# EAGLE design main_328p (EAGLE 9.6.2)
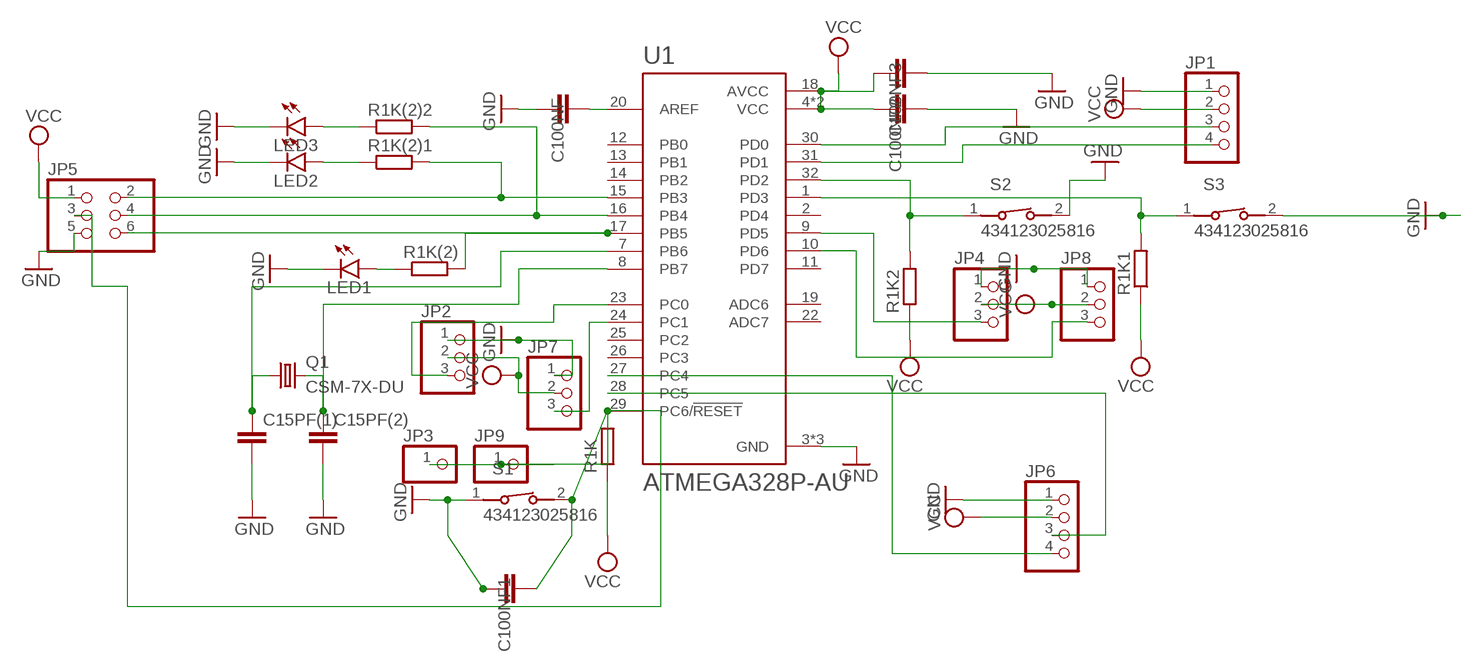
[diagram p0: schematic, sheet 1]

## Parts
C15PF(1)  C-EUC0603  [C0603]
C15PF(2)  C-EUC0603  [C0603]
C100NF  C-EUC0603  [C0603]
C100NF1  C-EUC0603  [C0603]
C100NF2  C-EUC0603  [C0603]
C100NF3  C-EUC0603  [C0603]
JP1  PINHD-1X04_2.54-SMD  [1X04SMD]
JP2  PINHD-1X03_2.54-SMD  [1X03SMD]
JP3  PINHD-1X01_2.54  [1X01]
JP4  PINHD-1X03_2.54-SMD  [1X03SMD]
JP5  PINHD-2X03_2.54-SMD  [2X03SMD]
JP6  PINHD-1X04_2.54-SMD  [1X04SMD]
JP7  PINHD-1X03_2.54-SMD  [1X03SMD]
JP8  PINHD-1X03_2.54-SMD  [1X03SMD]
JP9  PINHD-1X01_2.54  [1X01]
LED1  LEDCHIPLED_1206  [CHIPLED_1206]
LED2  LEDCHIPLED_1206  [CHIPLED_1206]
LED3  LEDCHIPLED_1206  [CHIPLED_1206]
Q1  CSM-7X-DU  [CSM-7X-DU]
R1K  R-EU_R1206  [R1206]
R1K1  R-EU_R1206  [R1206]
R1K2  R-EU_R1206  [R1206]
R1K(2)  R-EU_R1206  [R1206]
R1K(2)1  R-EU_R1206  [R1206]
R1K(2)2  R-EU_R1206  [R1206]
S1  434123025816  [434123025816]
S2  434123025816  [434123025816]
S3  434123025816  [434123025816]
U1  ATMEGA328P-AU  [QFP80P900X900X120-32N]

## Nets
GND: C15PF(1).2 C15PF(2).2 C100NF1.1 C100NF2.2 C100NF3.2 C100NF.1 JP1.1 JP2.1 JP4.1 JP5.5 JP6.1 JP7.1 JP8.1 LED1.C LED2.C LED3.C S1.1 S2.2 S3.2 U1.3(GND) U1.5(GND) U1.21(GND)
N$1: JP2.3 U1.23(PC0)
N$2: C15PF(1).1 Q1.1 U1.7(PB6)
N$3: LED1.A R1K(2).1
N$4: C100NF.2 U1.20(AREF)
N$5: JP7.3 U1.24(PC1)
N$6: JP5.6 R1K(2).2 U1.17(PB5)
N$7: LED3.A R1K(2)2.1
N$8: LED2.A R1K(2)1.1
N$9: JP6.4 U1.27(PC4)
N$10: C15PF(2).1 Q1.2 U1.8(PB7)
N$11: JP6.3 U1.28(PC5)
N$12: R1K2.2 S2.1 U1.32(PD2)
N$13: JP5.2 R1K(2)1.2 U1.15(PB3)
N$14: R1K1.2 S3.1 U1.1(PD3)
N$15: JP1.3 U1.30(PD0)
N$16: JP1.4 U1.31(PD1)
N$17: JP4.3 U1.9(PD5)
N$18: JP8.3 U1.10(PD6)
N$26: C100NF1.2 JP3.1 JP5.3 JP9.1 R1K.2 S1.2 U1.29(PC6/!RESET)
N$27: JP5.4 R1K(2)2.2 U1.16(PB4)
VCC: C100NF2.1 C100NF3.1 JP1.2 JP2.2 JP4.2 JP5.1 JP6.2 JP7.2 JP8.2 R1K1.1 R1K2.1 R1K.1 U1.4(VCC) U1.6(VCC) U1.18(AVCC)
Unconnected: U1.2(PD4) U1.11(PD7) U1.12(PB0) U1.13(PB1) U1.14(PB2) U1.19(ADC6) U1.22(ADC7) U1.25(PC2) U1.26(PC3)

## Library data of the parts
C15PF(1) C15PF(2) C100NF C100NF1-C100NF3 = rcl:C-EU: CAPACITOR, European symbol; SPICEPREFIX: C
JP1 JP6 = pinhead-2:PINHD-1X04: PIN HEADER
JP2 JP4 JP7 JP8 = pinhead-2:PINHD-1X03: PIN HEADER
JP3 JP9 = pinhead-2:PINHD-1X01: PIN HEADER
JP5 = pinhead-2:PINHD-2X03: PIN HEADER
LED1-LED3 = led:LED: LED OSRAM: - CHIPLED LG R971, LG N971, LY N971, LG Q971, LY Q971, LO R971, LY R971 LH N974, LH R974 LS Q976, LO Q976, LY Q976 LO Q996 - Hyper CHIPLED LW Q18S LB Q993, LB Q99A, LB R99A - SideLED LS A670, LO A670, LY A670, LG A670, LP A670 LB A673, LV A673, LT A673, LW A673 LH A674 LY A675 LS A676, LA A676, LO A676, LY A676, LW A676 LS A679, LY A679, LG A679 - Hyper Micro SIDELED® LS Y876, LA Y876, LO Y876, LY Y876 LT Y87S - SmartLED LW L88C, LW L88S LB L89C, LB L89S, LG L890 LS L89K, LO L89K, LY L89K LS L896, LA L896, LO L896, LY L896 - TOPLED LS T670, LO T670, LY T670, LG T670, LP T670 LSG T670, LSP T670, LSY T670, LOP T670, LYG T670 LG T671, LOG T671, LSG T671 LB T673, LV T673, LT T673, LW T673 LH T674 LS T676, LA T676, LO T676, LY T676, LB T676, LH T676, LSB T676, LW T676 LB T67C, LV T67C, LT T67C, LS T67K, LO T67K, LY T67K, LW E67C LS E67B, LA E67B, LO E67B, LY E67B, LB E67C, LV E67C, LT E67C LW T67C LS T679, LY T679, LG T679 LS T770, LO T770, LY T770, LG T770, LP T770 LB T773, LV T773, LT T773, LW T773 LH T774 LS E675, LA E675, LY E675, LS T675 LS T776, LA T776, LO T776, LY T776, LB T776 LHGB T686 LT T68C, LB T68C - Hyper Mini TOPLED® LB M676 - Mini TOPLED Santana® LG M470 LS M47K, LO M47K, LY M47K Source: http://www.osram.convergy.de LUXEON: - LUMILED® LXK2-PW12-R00, LXK2-PW12-S00, LXK2-PW14-U00, LXK2-PW14-V00 LXK2-PM12-R00, LXK2-PM12-S00, LXK2-PM14-U00 LXK2-PE12-Q00, LXK2-PE12-R00, LXK2-PE12-S00, LXK2-PE14-T00, LXK2-PE14-U00 LXK2-PB12-K00, LXK2-PB12-L00, LXK2-PB12-M00, LXK2-PB14-N00, LXK2-PB14-P00, LXK2-PB14-Q00 LXK2-PR12-L00, LXK2-PR12-M00, LXK2-PR14-Q00, LXK2-PR14-R00 LXK2-PD12-Q00, LXK2-PD12-R00, LXK2-PD12-S00 LXK2-PH12-R00, LXK2-PH12-S00 LXK2-PL12-P00, LXK2-PL12-Q00, LXK2-PL12-R00 Source: www.luxeon.com KINGBRIGHT: KA-3528ASYC Source: www.kingbright.com
Q1 = crystal:CSM-7X-DU: SMD CRYSTAL Source: www.ecsxtal.com .. Crystal 3.6864MHz CSM_7X_DU.PDF; OC_FARNELL: unknown; OC_NEWARK: unknown
R1K R1K1 R1K2 R1K(2) R1K(2)1 R1K(2)2 = rcl:R-EU_: RESISTOR, European symbol; SPICEPREFIX: R
S1-S3 = 434123025816:434123025816: 6.0x3.8 mm SMD J-Bend WS-TASV <http://katalog.we-online.de/media/images/v2/Family_WS-TASV_J-Bend_SMD_6.0x3.jpg> Details see: http://katalog.we-online.de/em/datasheet/4341x30258xx.pdf 2015 (C) Wurth Elektronik; AVAILABILITY: Unavailable; DESCRIPTION: Tactile Switch SPST-NO Top Actuated Surface Mount; MF: Wurth Electronics; MP: 434123025816; PACKAGE: None; PRICE: None
U1 = ATMEGA328P-AU:ATMEGA328P-AU: ATmega Series 20 MHz 32 KB Flash 2 KB SRAM 8-Bit Microcontroller - TQFP-32; AVAILABILITY: Unavailable; DESCRIPTION: AVR AVR® ATmega Microcontroller IC 8-Bit 20MHz 32KB _16K x 16_ FLASH 32-TQFP _7x7_; MF: Microchip Technology; MP: ATMEGA328P-AU; PACKAGE: TQFP-32 Microchip Technology; PRICE: None

## Board
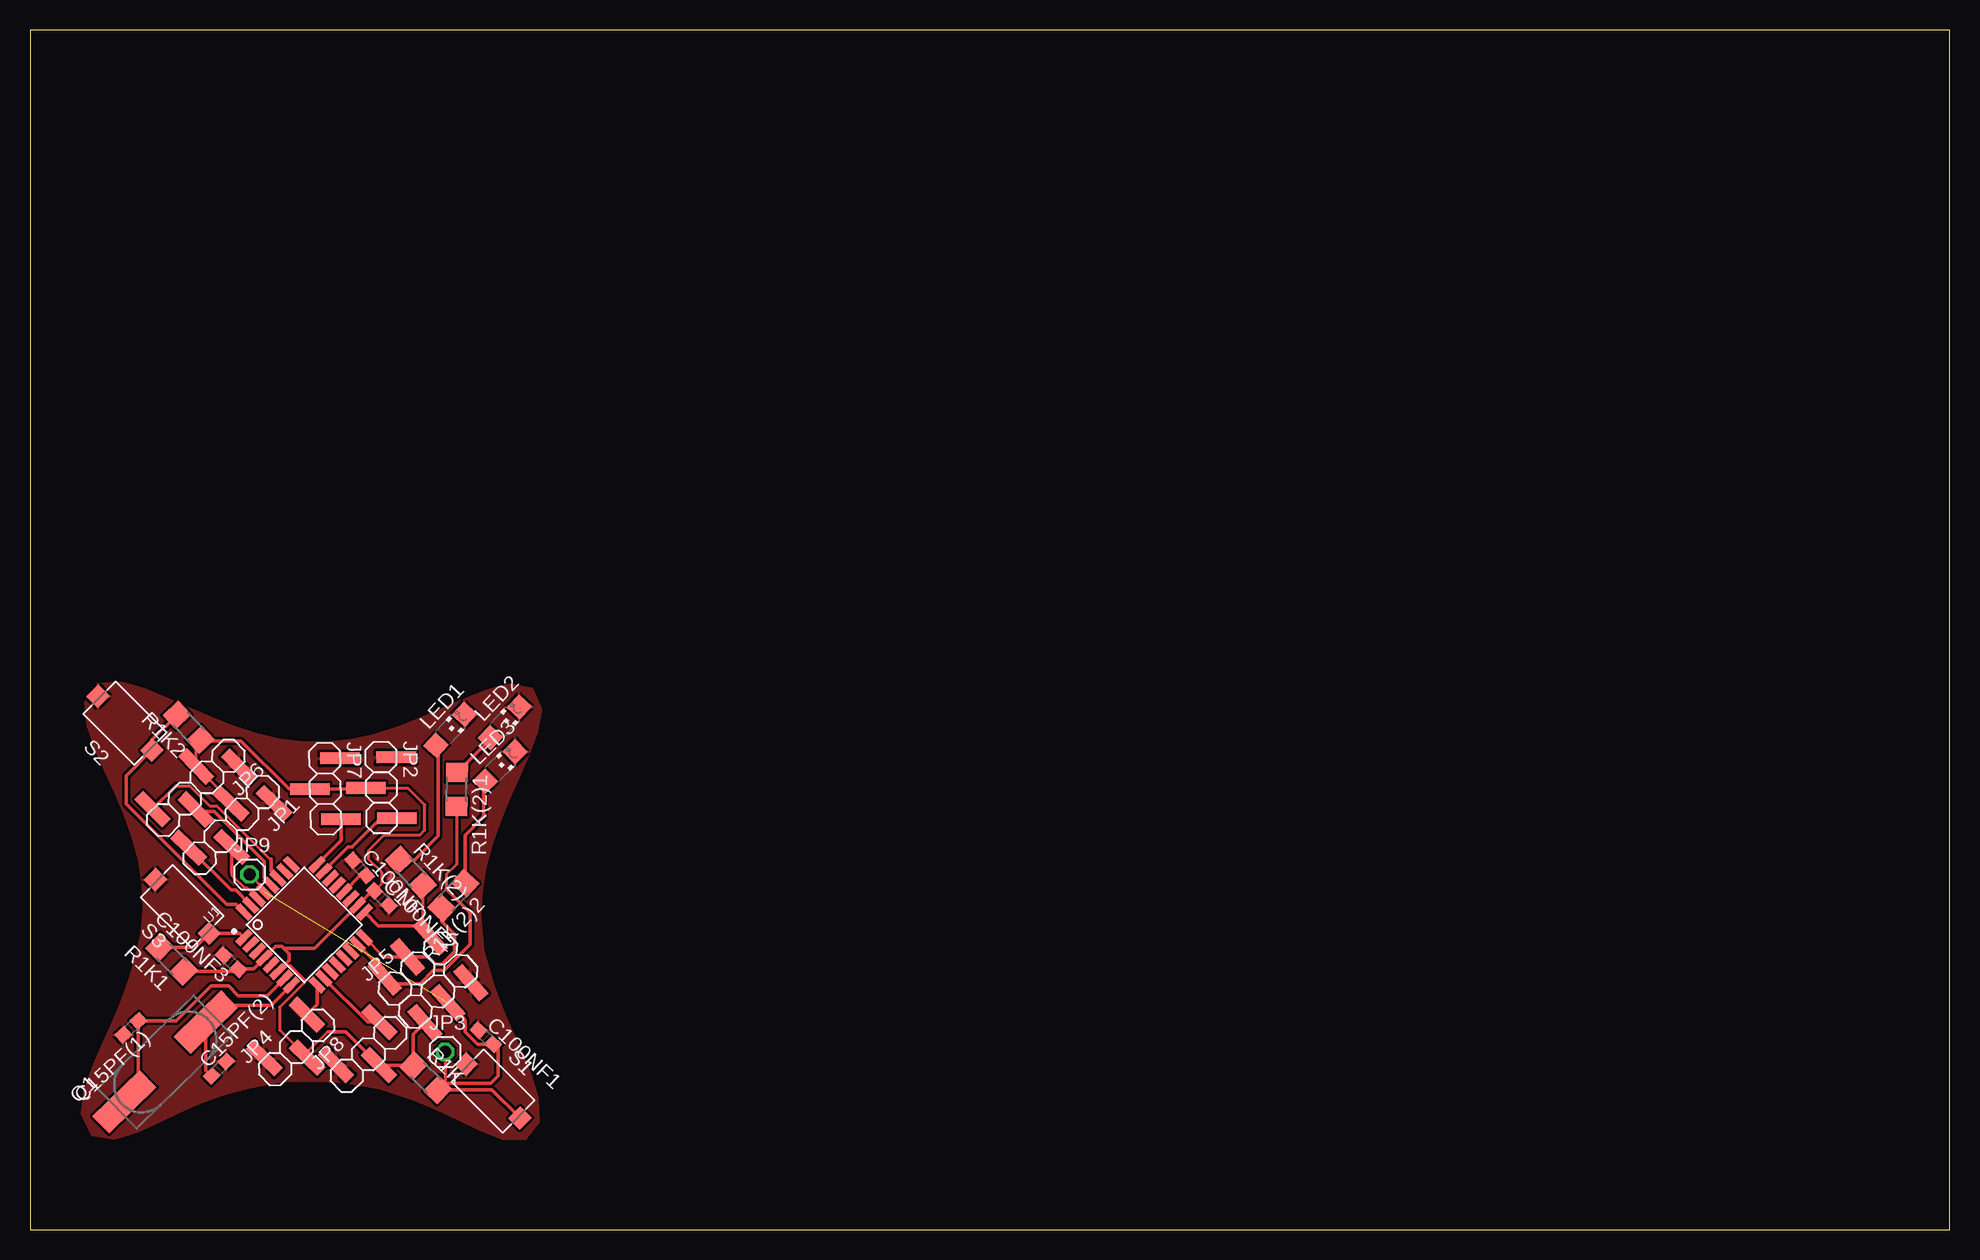
[diagram p1: board, top side]

Size 160 x 100 mm. Coordinates in mm from the lower left corner, seen from the top.
Outline: 0,0 160,0 160,100 0,100 0,0
Copper layers (1*16): Top 0.035mm / dielectric 1.5mm / Bottom 0.035mm
Design rules "default *": minimum track width 6mil, minimum drill 0.35mm, track to track 8mil, track to pad 8mil, pad to pad 8mil, via to via 8mil, smd to smd 8mil, copper to edge 40mil, drill to drill 6mil, minimum pad ring 10mil, minimum via ring 8mil, stop-mask expansion 4mil, vias tented up to drill 0mil, thermal gap 10mil

### Footprints (pad centres in the part's own frame; a part is rotated, then mirrored left to right if it is on the bottom)
C0603 = smd 1.1 x 1: 1 -0.85,0; 2 0.85,0
1X04SMD = smd 1.016 x 3.302: 1 -1.27,1.27; 2 1.27,-1.27; 3 3.81,1.27; 4 6.35,-1.27
1X03SMD = smd 1.016 x 3.302: 1 -1.27,1.27; 2 1.27,-1.27; 3 3.81,1.27
1X01 = drill 1.016 octagon: 1 0,0
2X03SMD = smd 1.016 x 3.302: 1 -1.27,-3.81; 2 -1.27,1.27; 3 1.27,-3.81; 4 1.27,1.27; 5 3.81,-3.81; 6 3.81,1.27
CHIPLED_1206 = smd 1.5 x 1.5: A 0,-1.75; C 0,1.75
CSM-7X-DU = smd 5.5 x 2: 1 -4.75,0; 2 4.75,0
R1206 = smd 1.6 x 1.803: 1 -1.422,0; 2 1.422,0
434123025816 = smd 1.35 x 1.4: 1 -3.175,0; 2 3.175,0
QFP80P900X900X120-32N = smd 1.5 x 0.55: 1 -4.3,2.8; 2 -4.3,2; 3 -4.3,1.2; 4 -4.3,0.4; 5 -4.3,-0.4; 6 -4.3,-1.2; 7 -4.3,-2; 8 -4.3,-2.8; 17 4.3,-2.8; 18 4.3,-2; 19 4.3,-1.2; 20 4.3,-0.4; 21 4.3,0.4; 22 4.3,1.2; 23 4.3,2; 24 4.3,2.8 | smd 0.55 x 1.5: 9 -2.8,-4.3; 10 -2,-4.3; 11 -1.2,-4.3; 12 -0.4,-4.3; 13 0.4,-4.3; 14 1.2,-4.3; 15 2,-4.3; 16 2.8,-4.3; 25 2.8,4.3; 26 2,4.3; 27 1.2,4.3; 28 0.4,4.3; 29 -0.4,4.3; 30 -1.2,4.3; 31 -2,4.3; 32 -2.8,4.3

### Placement (x,y rotation side)
C15PF(1)  8.4,16.81 222.7 top
C15PF(2)  15.75,13.4 45.4 top
C100NF  27.48,30.14 311.4 top
C100NF1  38,16.03 316.6 top
C100NF2  29.31,27.62 315.1 top
C100NF3  16.75,22.28 136.4 top
JP1  18.55,35.53 226.2 top
JP2  29.27,38.09 270.5 top
JP3  34.6,14.8 0 top
JP4  21.32,14.3 45.6 top
JP5  31.36,20.93 41.4 top
JP6  15.65,38.58 224.4 top
JP7  24.59,38 270.9 top
JP8  27.3,13.72 44.5 top
JP9  18.3,29.6 0 top
LED1  35.03,41.66 317.3 top
LED2  39.58,42.29 316.6 top
LED3  39.19,38.61 314.5 top
Q1  11.26,13.97 44.3 top
R1K  32.97,12.64 315.7 top
R1K1  11.8,22.51 135.4 top
R1K2  13.23,41.86 133.4 top
R1K(2)  31.75,29.76 312.6 top
R1K(2)1  35.57,36.69 269.2 top
R1K(2)2  35.3,27.84 226.8 top
S1  38.6,11.54 315 top
S2  7.92,42.21 135 top
S3  12.69,26.93 135 top
U1  22.86,25.4 45 top

### Tracks (layer width: path | path; a pad name or v marks a point on that pad's centre or on a via)
GND
  Top 0.254: 29.91,29.21 30.1,29.4 30.1,29.7 | 28.95,30.85 28.95,30.95 | JP2.1 31.83,39.37
  pour Top: 42.32,41.39 42.68,43.35 41.92,45.12 39.99,45.47 38.04,44.99 36.18,44.25 34.35,43.43 32.51,42.63 30.64,41.9 28.73,41.29 26.77,40.85 24.78,40.63 22.77,40.65 20.79,40.91 18.83,41.37 16.93,41.99 15.06,42.72 13.22,43.52 11.39,44.33 9.53,45.08 7.6,45.63 5.62,45.52 4.52,43.96 4.72,41.97 5.38,40.08 6.19,38.24 7.02,36.42 7.8,34.57 8.48,32.68 9,30.75 9.32,28.77 9.39,26.76 9.22,24.77 8.82,22.8 8.25,20.88 7.55,19 6.76,17.16 5.94,15.32 5.15,13.48 4.5,11.59 4.23,9.61 5.09,7.87 7.01,7.53 8.93,8.11 10.75,8.95 12.57,9.8 14.41,10.59 16.3,11.26 18.24,11.79 21.21,12.34 24.21,12.37 26.21,12.22 29.15,11.75 32.04,10.77 33.89,10 35.7,9.14 37.5,8.25 39.36,7.51 41.33,7.46 42.5,8.98 42.41,10.97 41.82,12.89 41.05,14.74 40.23,16.57 39.44,18.41 38.73,20.29 37.84,23.26 37.62,26.18 37.71,28.18 38.04,30.16 38.56,32.1 39.22,33.99 39.99,35.84 40.81,37.67 41.61,39.51
N$1
  Top 0.305: U1.23 26.52,31.89 26.84,31.89 29.25,34.29 JP2.3
N$2
  Top 0.305: Q1.1 9.03,11.82 C15PF(1).1 12.19,17.39 15.1,20.3 16.55,20.3 17.36,19.49 19.78,19.49 U1.7
N$3
  Top 0.305: R1K(2).1 32.04,30.81 34.04,32.8 34.04,40.18 LED1.A
N$4
  Top 0.305: U1.20 27.53,29.5 C100NF.2
N$5
  Top 0.305: U1.24 25.92,32.42 JP7.3
N$6
  Top 0.254: R1K(2).2 32.71,25.07 JP5.6 32.48,25.3
  Top 0.305: U1.17 29.04,25.3 32.48,25.3 | 33.4,24.42 JP5.6
N$7
  Top 0.305: R1K(2)2.1 36.27,32.87 37.82,34.42 37.82,37.26 LED3.A
N$8
  Top 0.305: R1K(2)1.1 38.38,40.9 LED2.A
N$9
  Top 0.254: 12.18,37 13.3,37 14.97,35.33 15.55,35.33 19.98,30.9 20.1,30.9
  Top 0.305: JP6.4 12.18,37 | U1.27 20.1,29.86 20.1,30.9
N$10
  Top 0.254: Q1.2 14.84,17.46
  Top 0.305: Q1.2 14.66,13.29 C15PF(2).1 | 14.84,17.46 16.07,18.7 20.12,18.7 U1.8
N$11
  Top 0.305: JP6.3 13.65,34.84 15.36,34.84 19.5,30.7 19.5,29.33 U1.28
N$12
  Top 0.305: U1.32 17.2,27.1 16.4,27.1 8,35.5 8,37.8 S2.1 10.16,40.8 R1K2.2
N$13
  Top 0.254: R1K(2)1.2 35.55,30.45 34.7,29.6 34.7,28.4
  Top 0.305: U1.15 29.57,21.52 JP5.2 30.11,20.5 32.5,20.5 33.59,21.59 34.51,21.59 36.7,23.78 36.7,26.4 34.7,28.4
N$14
  Top 0.305: R1K1.2 13.76,23.51 S3.1 17.49,24.68 U1.1
N$15
  Top 0.254: U1.30 18.05,28.51 17.85,28.51 16.83,29.53 16.83,29.73
  Top 0.305: JP1.3 16.83,29.73
N$16
  Top 0.305: JP1.4 16.76,28.3 17.13,28.3 U1.31
N$17
  Top 0.305: U1.9 23.92,18.75 JP4.3
N$18
  Top 0.305: U1.10 28.14,17.3 JP8.3
N$26  (1 unrouted)
  Top 0.254: 38.5,15.56 38.68,15.38 | JP9.1 19.54,28.36 U1.29 | JP3.1 34.6,12.26 R1K.2
  Top 0.305: S1.2 38.49,11.65 R1K.2 34.54,12.2 38.4,12.2 39,12.8 39,15.06 38.68,15.38 C100NF1.2 37.31,15.45 36.28,16.48 36.28,17.46 JP5.3
N$27
  Top 0.254: U1.16 29.5,22.72
  Top 0.305: 29.5,22.72 JP5.4 33.18,22.72 33.8,22.1 34.3,22.1 35.4,23.2 35.4,24.6 34.33,25.67 R1K(2)2.2
VCC
  Top 0.254: JP1.2 16.75,35.7 JP6.2 13.85,40.47 R1K2.1 | U1.6 20.94,21.51 21.43,22 21.71,22 22.85,20.85 22.85,20.58 20.8,18.52 20.8,16.64 JP4.2 23.12,14.82 24.8,16.5 | JP2.2 31.49,36.81 32.9,35.4 32.9,33.3 32.5,32.9 29.52,32.9 28.25,31.62 28.25,30.85 29.3,29.8 29.3,28.81 C100NF2.1
  Top 0.305: 21.15,23.45 21,23.6 20.49,23.6 U1.4 18.64,21.74 17.41,21.74 C100NF3.1 17.18,21.51 R1K1.1 | 21.15,23.45 21.6,23 21.6,22.44 U1.6 | C100NF2.1 28.51,28.22 U1.18 23.74,23.45 21.15,23.45 | 24.8,16.5 26.3,16.5 JP8.2 31.88,13.7 R1K.1 31.95,16.26 JP5.1 | JP2.2 27.91,36.71 JP7.2 21.59,36.71 17.57,40.73 14.31,40.73 R1K2.1